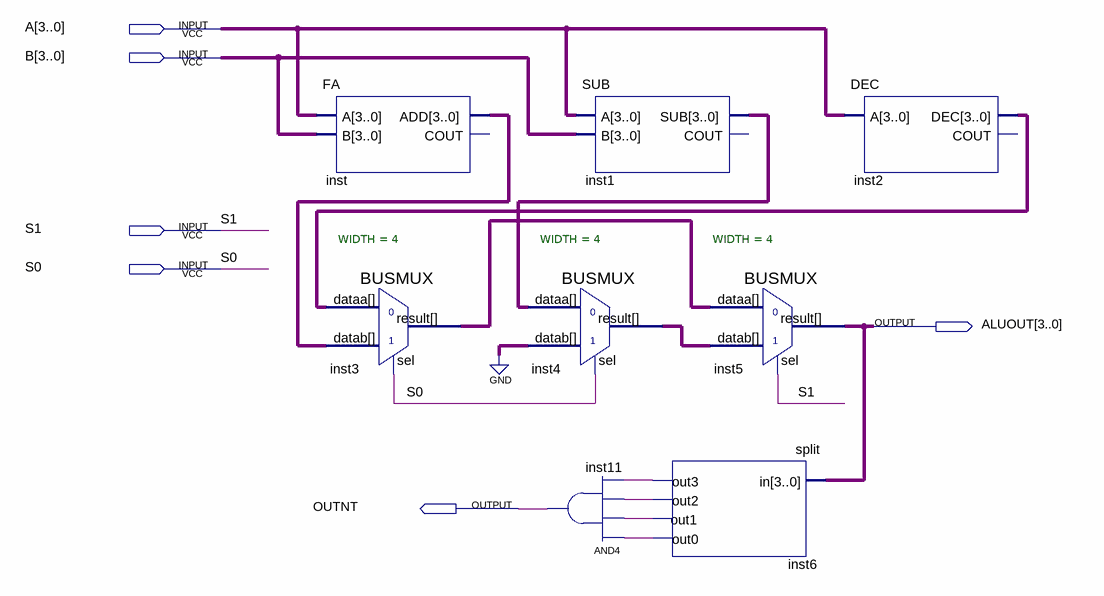
[diagram p0: schematic sheet]
// Quartus schematic ALU.bdf as structural Verilog: 8 symbols, 6 pins
module ALU (
  input  [3:0] A,
  input  [3:0] B,
  input  S1,
  input  S0,
  output [3:0] ALUOUT,
  output OUTNT
);

  wire inst6_out0, inst6_out1, inst6_out2, inst6_out3;
  wire [3:0] inst1_sub, inst2_dec, inst3_result, inst4_result, inst_add;

  FA inst (.A(A), .B(B), .ADD(inst_add));  // open: COUT
  BUSMUX #(.WIDTH(4)) inst3 (.datab(inst_add), .sel(S0), .dataa(inst2_dec), .result(inst3_result));
  BUSMUX #(.WIDTH(4)) inst4 (.datab(4'b0000), .sel(S0), .dataa(inst1_sub), .result(inst4_result));
  and inst11 (OUTNT, inst6_out0, inst6_out1, inst6_out2, inst6_out3);
  SUB inst1 (.A(A), .B(B), .SUB(inst1_sub));  // open: COUT
  BUSMUX #(.WIDTH(4)) inst5 (.datab(inst4_result), .sel(S1), .dataa(inst3_result), .result(ALUOUT));
  split inst6 (.in(ALUOUT), .out3(inst6_out3), .out2(inst6_out2), .out1(inst6_out1), .out0(inst6_out0));
  DEC inst2 (.A(A), .DEC(inst2_dec));  // open: COUT
endmodule
